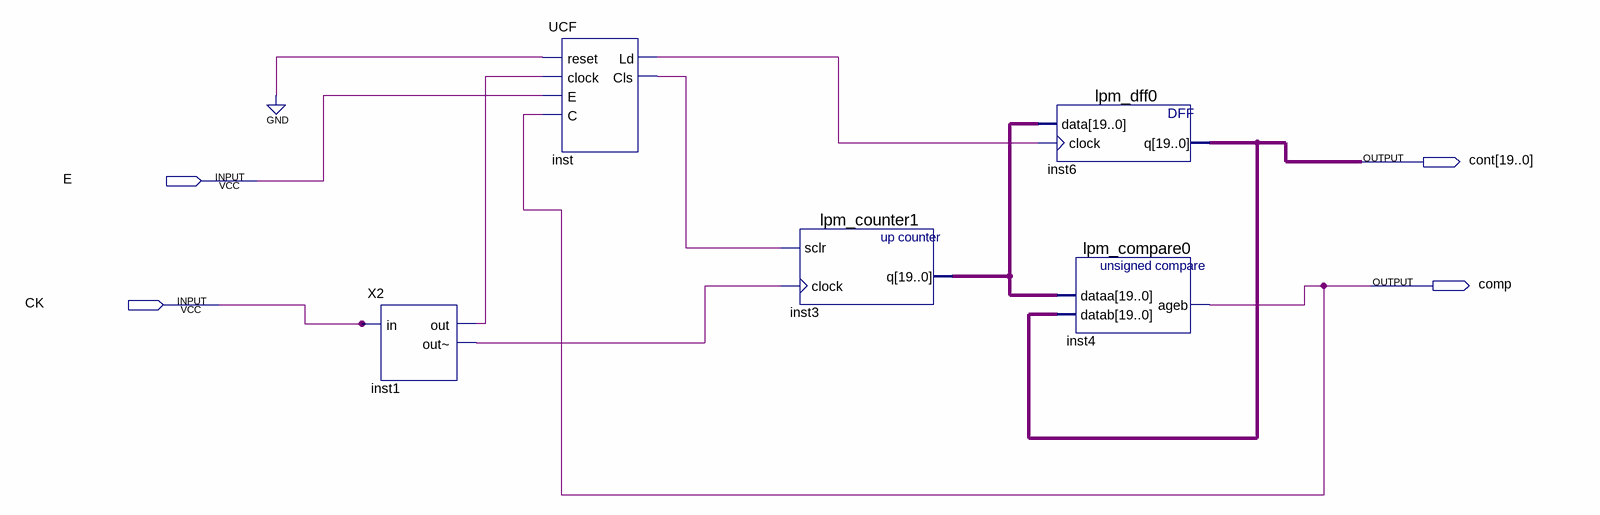
[diagram p0: schematic sheet]
// Quartus schematic Med_Per_Fase_fig15.bdf as structural Verilog: 5 symbols, 4 pins
module Med_Per_Fase_fig15 (
  input  E,
  input  CK,
  output [19:0] cont,
  output comp
);

  wire inst1_out, inst1_out_, inst_cls, inst_ld;
  wire [19:0] inst3_q;

  X2 inst1 (.in(CK), .out(inst1_out), .\out~ (inst1_out_));
  UCF inst (.reset(1'b0), .clock(inst1_out), .E(E), .C(comp), .Ld(inst_ld), .Cls(inst_cls));
  lpm_counter1 inst3 (.sclr(inst_cls), .clock(inst1_out_), .q(inst3_q));
  lpm_dff0 inst6 (.data(inst3_q), .clock(inst_ld), .q(cont));
  lpm_compare0 inst4 (.dataa(inst3_q), .datab(cont), .ageb(comp));
endmodule
